# EAGLE design sensorBoard (EAGLE 7.2.0)
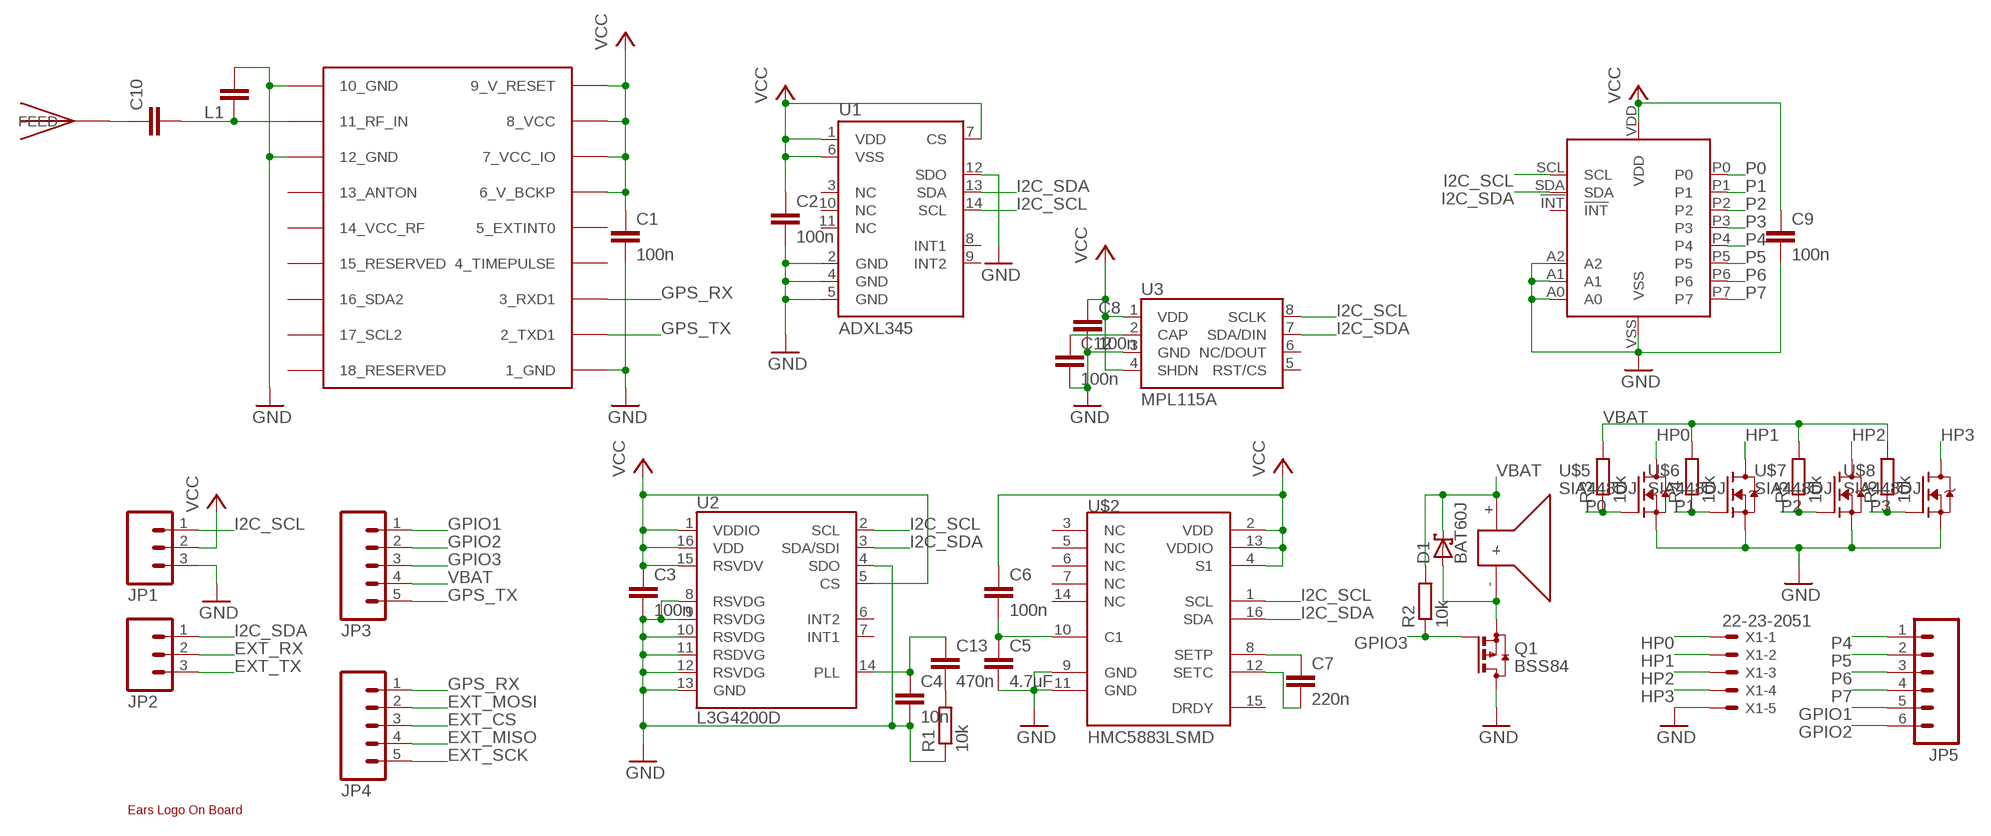
[diagram p0: schematic, sheet 1]

## Parts
C1  100n  C-EUC0402  [C0402]
C2  100n  C-EUC0402  [C0402]
C3  100n  C-EUC0402  [C0402]
C4  10n  C-EUC0402  [C0402]
C5  4.7uF  C-EUC0402  [C0402]
C6  100n  C-EUC0402  [C0402]
C7  220n  C-EUC0402  [C0402]
C8  100n  C-EUC0402  [C0402]
C9  100n  C-EUC0402  [C0402]
C10  C-EUC0603  [C0603]
C12  100n  C-EUC0402  [C0402]
C13  470n  C-EUC0402  [C0402]
D1  BAT60J  [SOD323_ST]
JP1  M03PTH  [1X03]
JP2  M03PTH  [1X03]
JP3  M05PTH  [1X05]
JP4  M05PTH  [1X05]
JP5  M06SIP  [1X06]
L1  C-EUC0603  [C0603]
Q1  BSS84  [SOT23]
R1  10k  R-EU_R0402  [R0402]
R2  10k  R-EU_R0402  [R0402]
R3  10k  R-EU_R0402  [R0402]
R4  10k  R-EU_R0402  [R0402]
R5  10k  R-EU_R0402  [R0402]
R6  10k  R-EU_R0402  [R0402]
U1  ADXL345  [LGA14]
U2  L3G4200D  [LGA16-4X4]
U3  MPL115A  [LGA8]
U$1  UBLOX_MAX  [UBLOX_MAX]
U$2  HMC5883LSMD  [16LPCC]
U$3  KSSG23J12  [KSSG23J12]
U$4  PCAL9554B  [PCAL9554B]
U$5  SIA448DJ  [SIA448DJ]
U$6  SIA448DJ  [SIA448DJ]
U$7  SIA448DJ  [SIA448DJ]
U$8  SIA448DJ  [SIA448DJ]
U$9  JTI_ANTENNA-1575AT43A40  [JTI_ANTENNA-1575AT43A40]
U$10  EARS-LOGO  [EARS-LOGO]
X1  22-23-2051  [22-23-2051]

## Nets
EXT_CS: JP4.3
EXT_MISO: JP4.4
EXT_MOSI: JP4.2
EXT_RX: JP2.2
EXT_SCK: JP4.5
EXT_TX: JP2.3
GND: C1.2 C2.2 C3.2 C4.2 C5.2 C8.2 C9.2 C12.2 JP1.3 L1.2 Q1.3(D) R1.1 U1.2(GND) U1.4(GND) U1.5(GND) U1.12(SDO) U2.4(SDO) U2.8(RSVDG) U2.9(RSVDG) U2.10(RSVDG) U2.11(RSDVG) U2.12(RSVDG) U2.13(GND) U3.3(GND) U$1.1_GND U$1.10_GND U$1.12_GND U$2.9(GND) U$2.11(GND) U$4.A0 U$4.A1 U$4.A2 U$4.VSS U$5.S0(S) U$5.S4(S) U$6.S0(S) U$6.S4(S) U$7.S0(S) U$7.S4(S) U$8.S0(S) U$8.S4(S) X1.5
GPIO1: JP3.1 JP5.5
GPIO2: JP3.2 JP5.6
GPIO3: JP3.3 Q1.1(G) R2.1
GPS_RX: JP4.1 U$1.3_RXD1
GPS_TX: JP3.5 U$1.2_TXD1
HP0: U$5.D0(D) U$5.D1(D) U$5.D2(D) U$5.D5(D) U$5.D6(D) X1.1
HP1: U$6.D0(D) U$6.D1(D) U$6.D2(D) U$6.D5(D) U$6.D6(D) X1.2
HP2: U$7.D0(D) U$7.D1(D) U$7.D2(D) U$7.D5(D) U$7.D6(D) X1.3
HP3: U$8.D0(D) U$8.D1(D) U$8.D2(D) U$8.D5(D) U$8.D6(D) X1.4
I2C_SCL: JP1.1 U1.14(SCL) U2.2(SCL) U3.8(SCLK) U$2.1(SCL) U$4.SCL
I2C_SDA: JP2.1 U1.13(SDA) U2.3(SDA/SDI) U3.7(SDA/DIN) U$2.16(SDA) U$4.SDA
N$1: C4.1 C13.1 U2.14(PLL)
N$2: C5.1 C6.2 U$2.10(C1)
N$3: C7.2 U$2.12(SETC)
N$4: C7.1 U$2.8(SETP)
N$5: D1.A Q1.2(S) U$3.-
N$6: C10.1 U$9.FEED
N$7: C10.2 L1.1 U$1.11_RF_IN
N$8: C12.1 U3.2(CAP)
N$9: C13.2 R1.2
P0: R3.1 U$4.P0 U$5.G3(G)
P1: R4.1 U$4.P1 U$6.G3(G)
P2: R5.1 U$4.P2 U$7.G3(G)
P3: R6.1 U$4.P3 U$8.G3(G)
P4: JP5.1 U$4.P4
P5: JP5.2 U$4.P5
P6: JP5.3 U$4.P6
P7: JP5.4 U$4.P7
VBAT: D1.C JP3.4 R2.2 R3.2 R4.2 R5.2 R6.2 U$3.+
VCC: C1.1 C2.1 C3.1 C6.1 C8.1 C9.1 JP1.2 U1.1(VDD) U1.6(VSS) U1.7(CS) U2.1(VDDIO) U2.5(CS) U2.15(RSVDV) U2.16(VDD) U3.1(VDD) U3.4(SHDN) U$1.6_V_BCKP U$1.7_VCC_IO U$1.8_VCC U$1.9_V_RESET U$2.2(VDD) U$2.4(S1) U$2.13(VDDIO) U$4.VDD
Unconnected: U1.3(NC) U1.8(INT1) U1.9(INT2) U1.10(NC) U1.11(NC) U2.6(INT2) U2.7(INT1) U3.5(RST/CS) U3.6(NC/DOUT) U$1.4_TIMEPULSE U$1.5_EXTINT0 U$1.13_ANTON U$1.14_VCC_RF U$1.15_RESERVED U$1.16_SDA2 U$1.17_SCL2 U$1.18_RESERVED U$2.3(NC) U$2.5(NC) U$2.6(NC) U$2.7(NC) U$2.14(NC) U$2.15(DRDY) U$4.!INT

## Library data of the parts
C1-C10 C12 C13 L1 = rcl:C-EU: CAPACITOR, European symbol
D1 = diode:BAT60J: Schottky barrier diode Source: www.st.com, BAT60J.pdf; OC_FARNELL: 1466524
JP1 JP2 = SparkFun:M03: Header 3 Standard 3-pin 0.1" header. Use with straight break away headers (SKU : PRT-00116), right angle break away headers (PRT-00553), swiss pins (PRT-00743), machine pins (PRT-00117), and female headers (PRT-00115). Molex polarized connector foot print use with SKU : PRT-08232 with associated crimp pins and housings.
JP3 JP4 = SparkFun:M05: Header 5 Standard 5-pin 0.1" header. Use with straight break away headers (SKU : PRT-00116), right angle break away headers (PRT-00553), swiss pins (PRT-00743), machine pins (PRT-00117), and female headers (PRT-00115). Molex polarized connector foot print use with SKU : PRT-08230 with associated crimp pins and housings.
JP5 = SparkFun:M06: Header 6 Standard 6-pin 0.1" header. Use with straight break away headers (SKU : PRT-00116), right angle break away headers (PRT-00553), swiss pins (PRT-00743), machine pins (PRT-00117), and female headers (PRT-00115). Molex polarized connector foot print use with SKU : PRT-08094 with associated crimp pins and housings. NOTES ON THE VARIANTS LOCK and LOCK_LONGPADS... This footprint was designed to help hold the alignment of a through-hole component (i.e. 6-pin header) while soldering it into place. You may notice that each hole has been shifted either up or down by 0.005 of an inch from it's more standard position (which is a perfectly straight line). This slight alteration caused the pins (the squares in the middle) to touch the edges of the holes. Because they are alternating, it causes a "brace" to hold the component in place. 0.005 has proven to be the perfect amount of "off-center" position when using our standard breakaway headers. Although looks a little odd when you look at the bare footprint, once you have a header in there, the alteration is very hard to notice. Also, if you push a header all the way into place, it is covered up entirely on the bottom side. This idea of altering the position of holes to aid alignment will be further integrated into the Sparkfun Library for other footprints. It can help hold any component with 3 or more connection pins.
Q1 = transistor-small-signal:BSS84: P-CHANNEL MOS FET
R1-R6 = rcl:R-EU_: RESISTOR, European symbol
U1 = SparkFun:ADXL345; OC_FARNELL: 2361527
U2 = SparkFun:L3G4200D: L3G4200D Three-axis, digital output gyroscope The L3G4200D is a low-power three-axis angular rate sensor, has a full scale of ±250/±500/±2000 dps and is capable of measuring rates with a user-selectable bandwidth. It includes a sensing element and an IC interface capable of providing the measured angular rate to the external world through a digital interface (I2C/SPI). Package: 4x4x1.1 LGA-16 (LGA16-4x4.PAC); OC_FARNELL: 2433080
U3 = SparkFun:MPL115A: MPL115A1 (SPI) and MPL115A2 (I2C) Miniature Digital Barometer 5.0x3.0x1.2mm LGA Package; OC_FARNELL: 2009084
U$1 = Ava:UBLOX_MAX: UBLOX MAX
U$2 = SparkFun:HMC5883L: 3 Axis Digital Compass IC
U$3 = mattsLib:KSSG23J12; OC_FARNELL: 2215090
U$4 = mattsLib:PCAL9554B; OC_FARNELL: 2428176
U$5-U$8 = mattsLib:SIA448DJ; OC_FARNELL: 2283661
U$9 = Ava:JTI_ANTENNA-1575AT43A40
U$10 = earsLogo:EARS-LOGO
X1 = con-molex:22-23-2051: .100" (2.54mm) Center Header - 5 Pin; MF: MOLEX; MPN: 22-23-2051; OC_FARNELL: 1462952; OC_NEWARK: 38C9178

## Board
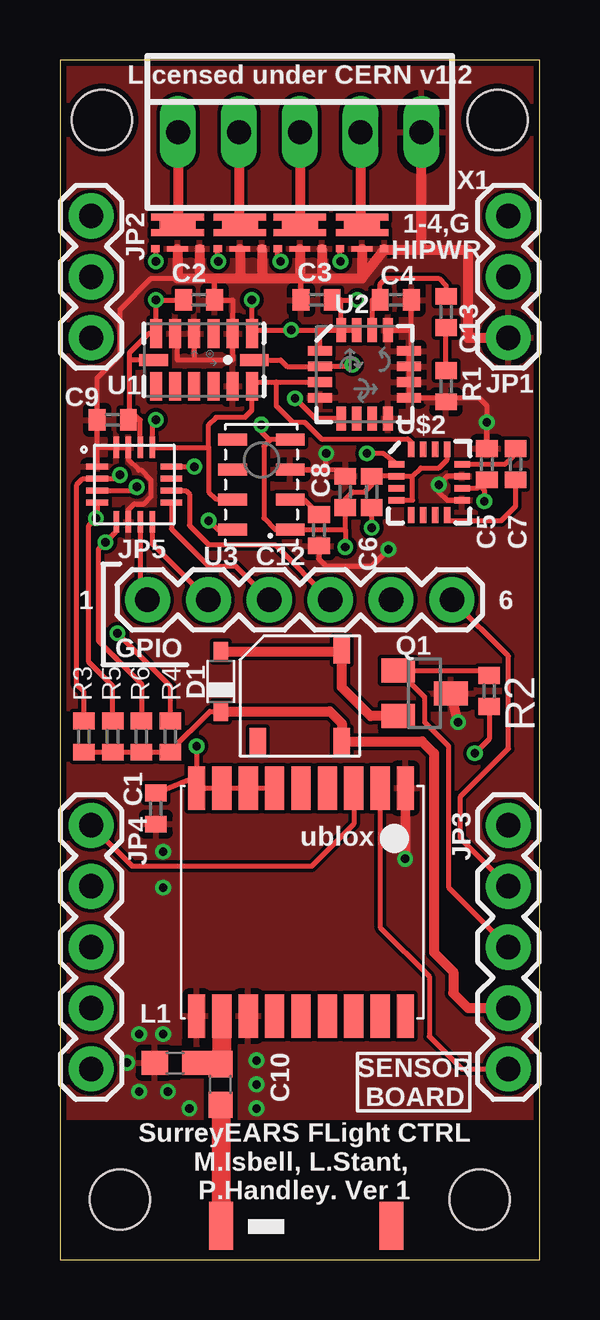
[diagram p1: board, top side]
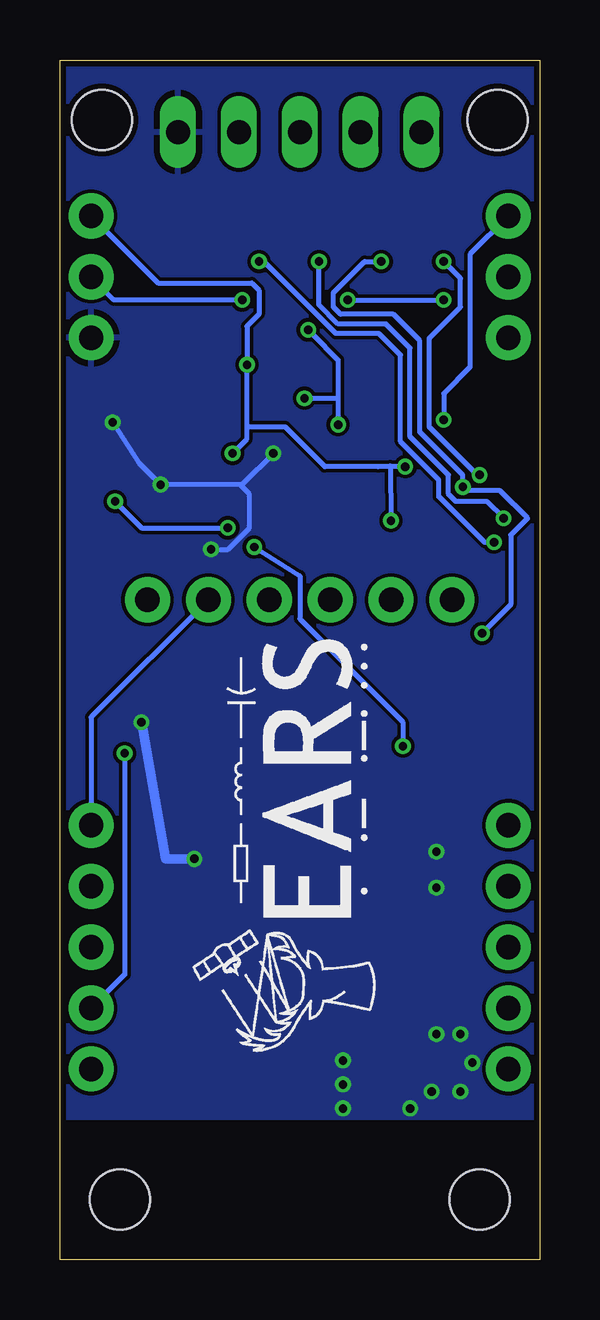
[diagram p2: board, bottom side, seen from below]

Size 20 x 50 mm. Coordinates in mm from the lower left corner, seen from the top.
Outline: 0,0 20,0 20,50 0,50 0,0
Copper layers (1*16): Top 0.035mm / dielectric 1.5mm / Bottom 0.035mm
Design rules "SeeedStudio_2layer_DRU_no_angle_20140221": minimum track width 6mil, minimum drill 12mil, track to track 6mil, track to pad 6mil, pad to pad 6mil, via to via 6mil, smd to smd 0mil, copper to edge 10mil, drill to drill 10mil, minimum pad ring 10mil, minimum via ring 6mil, stop-mask expansion 2mil, vias tented up to drill 100mil, thermal gap 10mil
Holes 2.5 mm at 1.75,47.5 18.25,47.5 2.5,2.5 17.5,2.5
tKeepout: area 0,45 to 3.5,50; area 16.5,45 to 20,50; area 0,0 to 5,5; area 15,0 to 20,5
bKeepout: area 0,45 to 3.5,50; area 16.5,45 to 20,50; area 0,0 to 5,5; area 15,0 to 20,5
tRestrict: area 6,5.7 to 7.4,9.2; area 4.5,7.5 to 5.3,9.2

### Footprints (pad centres in the part's own frame; a part is rotated, then mirrored left to right if it is on the bottom)
C0402 = smd 0.7 x 0.9: 1 -0.65,0; 2 0.65,0
C0603 = smd 1.1 x 1: 1 -0.85,0; 2 0.85,0
SOD323_ST = smd 0.8 x 0.6: A 1.25,0; C -1.25,0
1X03 = drill 1.016 pad 1.88: 1 0,0; 2 2.54,0; 3 5.08,0
1X05 = drill 1.016 pad 1.88: 1 0,0; 2 2.54,0; 3 5.08,0; 4 7.62,0; 5 10.16,0
1X06 = drill 1.016 pad 1.88: 1 0,0; 2 2.54,0; 3 5.08,0; 4 7.62,0; 5 10.16,0; 6 12.7,0
SOT23 = smd 1 x 1.4: 1 -0.95,-1.1; 2 0.95,-1.1; 3 0,1.1
R0402 = smd 0.7 x 0.9: 1 -0.65,0; 2 0.65,0
LGA14 = smd 0.5 x 1.2: 1 2,1.1; 2 1.2,1.1; 3 0.4,1.1; 4 -0.4,1.1; 5 -1.2,1.1; 6 -2,1.1; 8 -2,-1.1; 9 -1.2,-1.1; 10 -0.4,-1.1; 11 0.4,-1.1; 12 1.2,-1.1; 13 2,-1.1 | smd 1.2 x 0.5: 7 -2.1,0; 14 2.1,0
LGA16-4X4 = smd 1 x 0.4: 1 -1.85,0.975; 2 -1.85,0.325; 3 -1.85,-0.325; 4 -1.85,-0.975; 9 1.85,-0.975; 10 1.85,-0.325; 11 1.85,0.325; 12 1.85,0.975 | smd 0.4 x 1: 5 -0.975,-1.85; 6 -0.325,-1.85; 7 0.325,-1.85; 8 0.975,-1.85; 13 0.975,1.85; 14 0.325,1.85; 15 -0.325,1.85; 16 -0.975,1.85
LGA8 = smd 1.2 x 0.5: 1 -1.2,1.875; 2 -1.2,0.625; 3 -1.2,-0.625; 4 -1.2,-1.875; 5 1.2,-1.875; 6 1.2,-0.625; 7 1.2,0.625; 8 1.2,1.875
UBLOX_MAX = smd 1.8 x 0.7: 1_GND 4.95,-4.4; 9_V_RESET 4.95,4.3; 10_GND -4.55,4.3; 18_RESERVED -4.55,-4.4 | smd 1.8 x 0.8: 2_TXD1 4.95,-3.35; 3_RXD1 4.95,-2.25; 4_TIMEPULSE 4.95,-1.15; 5_EXTINT0 4.95,-0.05; 6_V_BCKP 4.95,1.05; 7_VCC_IO 4.95,2.15; 8_VCC 4.95,3.25; 11_RF_IN -4.55,3.25; 12_GND -4.55,2.15; 13_ANTON -4.55,1.05; 14_VCC_RF -4.55,-0.05; 15_RESERVED -4.55,-1.15; 16_SDA2 -4.55,-2.25; 17_SCL2 -4.55,-3.35
16LPCC = smd 0.65 x 0.28: 1 -1.37,0.75; 2 -1.37,0.25; 3 -1.37,-0.25; 4 -1.37,-0.75; 9 1.37,-0.75; 10 1.37,-0.25; 11 1.37,0.25; 12 1.37,0.75 | smd 0.28 x 0.65: 5 -0.75,-1.37; 6 -0.25,-1.37; 7 0.25,-1.37; 8 0.75,-1.37; 13 0.75,1.37; 14 0.25,1.37; 15 -0.25,1.37; 16 -0.75,1.37
KSSG23J12 = smd 1.1 x 0.7: + -1.9,-1.75; - 1.9,-1.75; P$3 -1.9,1.75
PCAL9554B = smd 0.9 x 0.24: !INT 1.55,0.25; A2 -1.55,0.75; P0 -1.55,0.25; P1 -1.55,-0.25; P2 -1.55,-0.75; P6 1.55,-0.75; P7 1.55,-0.25; SCL 1.55,0.75 | smd 0.24 x 0.9: A0 -0.25,1.55; A1 -0.75,1.55; P3 -0.75,-1.55; P4 0.25,-1.55; P5 0.75,-1.55; SDA 0.75,1.55; VDD 0.25,1.55; VSS -0.25,-1.55
SIA448DJ = smd 0.95 x 1.5: D0 -0.325,0 | smd 0.3 x 0.35: D1 -0.65,-0.925; D2 0,-0.925; D5 0,0.925; D6 -0.65,0.925; G3 0.667,-0.925; S4 0.667,0.925 | smd 0.235 x 0.87: S0 0.667,0
JTI_ANTENNA-1575AT43A40 = smd 1 x 2: FEED -3.175,0; NC 3.925,0
22-23-2051 = drill 1 long: 1 -5.08,0; 2 -2.54,0; 3 0,0; 4 2.54,0; 5 5.08,0

### Placement (x,y rotation side)
C1  4,18.8 270 top
C2  5.8,40 0 top
C3  10.7,40 180 top
C4  14,40 0 top
C5  17.8,33.15 90 top
C6  13,32 270 top
C7  19,33.15 90 top
C8  11.9,32 90 top
C9  2.2,35 180 top
C10  6.7,7.3 90 top
C12  10.8,30.4 270 top
C13  16.1,39.5 270 top
D1  6.7,24.1 90 top
JP1  18.7,43.5 270 top
JP2  1.3,43.5 270 top
JP3  18.7,18.1 270 top
JP4  1.3,18.1 270 top
JP5  3.65,27.5 0 top
L1  4.8,8.2 180 top
Q1  15.2,23.6 270 top
R1  16.1,36.4 90 top
R2  17.9,23.7 270 top
R3  1,21.8 270 top
R4  4.6,21.8 270 top
R5  2.2,21.8 270 top
R6  3.4,21.8 270 top
U1  6,37.5 0 top
U2  12.7,36.9 0 top
U3  8.4,32.3 180 top
U$1  10,14.7 90 top
U$2  15.4,32.4 0 top
U$3  10,23.5 90 top
U$4  3.1,32.3 0 top
U$5  4.9,42.8 270 top
U$6  7.5,42.8 270 top
U$7  10,42.8 270 top
U$8  12.6,42.8 270 top
U$9  9.9,1.4 0 top
U$10  9.7,18.1 90 bottom
X1  10,47 0 top

### Tracks (layer width: path | path; a pad name or v marks a point on that pad's centre or on a via)
GND  (via drill 0.35)
  Top 0.2: U$4.A2 1.55,33.85 | 1.55,33.85 C9.2 1.55,36.75 2.5,37.7 2.5,39.6 3.8,40.9 4.9,40.9 | 1.55,33.85 U$4.A1 U$4.A0 2.85,33.35 3.3,32.9 3.4,32.9 3.8,32.5 3.8,31.8 3.5,31.5 3.1,31.5 2.85,31.25 U$4.VSS | 6.3,40.9 6.45,41 C2.2 7.2,40 U1.2 7.2,37.5 5.6,37.5 | 5.6,37.5 4.9,37.5 4.9,38.6 U1.5 | U1.4 5.6,37.5 | C3.2 10.05,41 10,40.9 | U2.13 14.65,38.75 | 14.65,38.75 C4.2 | 14.65,38.75 14.65,37.88 U2.12 U2.11 U2.10 U2.9 17.48,35.92 17.8,35.6 C5.2 v17.8,34.9 | U3.3 11.2,32.92 | 11.2,32.92 11.8,32.92 11.8,32.8 C8.2 | U$2.11 16.15,32.65 v15.8,32.3 15.8,32 16.15,31.65 U$2.9 | 11.2,32.92 11.1,33.02 v11.1,33.6 | C12.2 10.8,29.2 11.1,28.9 13,28.9 v13.7,29.6
  Top 0.4: U$1.1_GND v14.4,16.7 | v16.6,22.4 Q1.3
  Top 0.406: U$5.S0 4.9,40.9 5.83,40.9 | 5.83,40.9 6.3,40.9 7.5,40.9 | 7.5,40.9 8.43,40.9 | 8.43,40.9 10,40.9 | 10,40.9 10.93,40.9 | 10.93,40.9 12.6,40.9 | 12.6,40.9 13.53,42.1 | 13.53,42.1 15.08,42.1 | 15.08,42.1 X1.5 | U$5.S4 5.83,40.9 | U$6.S0 7.5,40.9 | U$6.S4 8.43,40.9 | U$7.S0 10,40.9 | U$7.S4 10.93,40.9 | U$8.S0 12.6,40.9 | U$8.S4 13.53,42.1 | 15.08,42.1 17,42.1 17,38.42 JP1.3
  Bottom 0.2: v17.8,34.9 16.7,33.2 v15.8,32.3 12.5,32.3 | v11.1,33.6 12.4,32.3 12.5,32.3 | v13.7,29.6 13,29.6 12.1,30.5 12.1,31.9 12.5,32.3
  Bottom 0.4: v14.4,16.7 15.6,16.7 v16.6,22.4
  other vias: 5.4,6.3 4.5,7 3.3,7 3.3,9.4 4.3,9.4 2.8,8.2 8.2,8.3 8.2,7.3 8.2,6.3 4.3,17 4.3,15.5
  pour Bottom: 0,50 0,5.9 20,5.9 20,50
  pour Top: 20,5.9 0,5.9 0,50 20,50
GPIO1
  Bottom 0.2: JP5.5 18.7,22.61 JP3.1
GPIO2
  Top 0.2: JP3.2 16.7,17.56 16.7,19.3 18.7,21.3 18.7,25.15 JP5.6
GPIO3
  Top 0.2: JP3.3 16.2,15.52 16.2,21.4 15.2,22.4 15.2,23.45 Q1.1 17.9,24.55 R2.1
GPS_RX
  Top 0.2: U$1.3_RXD1 12.25,18.15 10.5,16.4 3,16.4 JP4.1
GPS_TX
  Top 0.2: U$1.2_TXD1 13.35,13.85 15.4,11.8 15.4,9.3 16.76,7.94 JP3.5
HP0
  Top 0.3: U$5.D1 4.9,43.45 | U$5.D6 4.9,43.45 | 4.9,43.45 U$5.D0 4.9,42.8 | U$5.D2 4.9,42.8 | U$5.D5 4.9,42.8
  Top 0.406: X1.1 4.92,43.12 U$5.D0
HP1
  Top 0.3: U$6.D2 7.5,42.8 | U$6.D1 7.5,43.45 | U$6.D6 7.5,43.45 | 7.5,43.45 U$6.D0 7.5,42.8 | U$6.D5 7.5,42.8
  Top 0.406: X1.2 7.46,43.12 U$6.D0
HP2
  Top 0.3: U$7.D1 10,43.45 | U$7.D2 10,42.8 | U$7.D5 10,42.8 | 10,42.8 U$7.D0 10,43.45 | U$7.D6 10,43.45
  Top 0.406: X1.3 U$7.D0
HP3
  Top 0.3: U$8.D1 12.6,43.45 | 12.6,43.45 U$8.D0 12.6,42.8 | U$8.D2 12.6,42.8 | 12.6,43.45 U$8.D6 | U$8.D5 12.6,42.8
  Top 0.406: X1.4 12.54,43.12 U$8.D0
I2C_SCL  (via drill 0.35)
  Top 0.2: U1.14 9.2,37.5 9.47,37.23 U2.2 12.12,37.23 v12.2,37.3 | U$2.1 13.48,33.6 v12.8,33.6 | U$4.SCL v5.6,33.05 | v6.2,30.8 6.6,30.43 U3.8
  Bottom 0.2: JP1.1 15.9,40.7 12,40.7 11.7,40.4 11.7,39.4 12.2,38.9 v12.2,37.3 12.2,34.7 | v12.8,33.6 12.2,34.2 12.2,34.7 | v5.6,33.05 6.72,33.05 | 6.72,33.05 8.95,33.05 10.6,34.7 12.2,34.7 | 6.72,33.05 6.22,33.08 v6.2,30.8
I2C_SDA  (via drill 0.35)
  Top 0.2: 6.2,33.85 U$4.SDA 3.85,34.85 v4,35 | 6.2,33.85 6.2,32 6.5,31.7 7.28,31.7 U3.7 | 6.2,33.85 6.2,34.8 6.5,35.1 7.7,35.1 8,35.4 U1.13 8.18,36.58 9.01,36.58 | 9.01,36.58 U2.3 | 9.01,36.58 9.01,35.59 9.7,34.9 10.2,34.9 10.9,34.2 14.5,34.2 14.65,34.05 U$2.16
  Bottom 0.2: JP2.1 2.9,41.9 2.9,37.2 4,36.1 v4,35
N$1
  Top 0.2: U2.14 13.03,40 C4.1 13.35,40.65 13.6,40.9 15.8,40.9 16.1,40.6 C13.1
N$2  (via drill 0.35)
  Top 0.2: U$2.10 17.4,32.15 17.51,32.26 | 17.51,32.26 C5.1 | 17.51,32.26 17.7,32.07 v17.7,31.6 | v13,30.5 C6.2
  Bottom 0.2: v17.7,31.6 16.6,30.5 v13,30.5
N$3
  Top 0.2: U$2.12 18.55,33.15 18.9,33.5 C7.2
N$4
  Top 0.2: C7.1 19,31.4 18.4,30.8 16.15,30.8 U$2.8
N$5
  Top 0.406: Q1.2 12.95,22.65 11.75,23.85 U$3.- 11.75,25.35 D1.A
N$6
  Top 0.8: C10.1 6.72,6.45 U$9.FEED
N$7
  Top 0.8: U$1.11_RF_IN 6.75,8.15 C10.2 5.65,8.15 L1.1
N$8
  Top 0.2: U3.2 10.18,31.68 C12.1
N$9
  Top 0.2: R1.2 C13.2
P0  (via drill 0.35)
  Top 0.2: v2.5,32.7 2.35,32.55 U$4.P0 0.95,32.55 0.7,32.3 0.7,23.95 1,23.65 R3.1 | v4,41.6 4,42.11 U$5.G3
  Bottom 0.2: v2.5,32.7 2.6,32.7 4.6,34.7 4.6,38.4 3.3,39.7 3.3,40.9 v4,41.6
P1  (via drill 0.35)
  Top 0.2: U$4.P1 3.05,32.05 v3.2,32.2 | v6.6,41.6 6.58,41.62 U$6.G3 | v2.4,26.1 4.6,23.9 R4.1
  Bottom 0.2: v6.6,41.6 7.3,41.6 8.6,40.3 8.6,39.7 8.3,39.4 6.1,39.4 5,38.3 5,34.5 3.2,32.7 v3.2,32.2 3.05,32.05 1.65,32.05 0.5,30.9 1.2,30.2 1.2,27.3 v2.4,26.1
P2  (via drill 0.35)
  Top 0.2: U$4.P2 1.55,30.95 v1.5,30.9 1.2,30.6 1.2,24.9 2.2,23.9 R5.1 | v9.2,41.6 9.07,41.73 U$7.G3
  Bottom 0.2: v1.5,30.9 2.2,31.6 3.5,31.6 3.8,31.9 3.8,32.7 5.4,34.3 5.4,38 6.4,39 8.4,39 9.2,39.8 v9.2,41.6
P3  (via drill 0.35)
  Top 0.2: v11.7,41.6 11.68,41.62 U$8.G3 | R6.1 3.4,24 1.6,25.8 1.6,29.6 v1.9,29.9 2.35,30.35 U$4.P3
  Bottom 0.2: v11.7,41.6 11.5,41.6 8.5,38.6 6.7,38.6 5.8,37.7 5.8,34.1 4.2,32.5 4.2,31.8 2.3,29.9 v1.9,29.9
P4
  Top 0.2: U$4.P4 3.35,27.8 JP5.1
P5
  Top 0.2: U$4.P5 3.85,29.84 JP5.2
P6
  Top 0.2: U$4.P6 4.65,30.45 6.2,28.9 7.33,28.9 JP5.3
P7
  Top 0.2: U$4.P7 5.25,32.05 5.4,31.9 5.4,30.6 6.2,29.8 8.97,29.8 JP5.4
VBAT  (via drill 0.35)
  Top 0.2: R2.2 17.9,21.7 v17.3,21.1 | R3.2 R5.2 R6.2 R4.2 4.6,21.2 6.25,22.85 D1.C
  Top 0.406: JP3.4 17.02,10.48 16.4,11.1 16.4,12 15.6,12.8 15.6,21.1 15.1,21.6 U$3.+ 11.75,22.35 11.25,22.85 D1.C
  Bottom 0.2: v17.3,21.1 17.3,11.88 JP3.4
VCC  (via drill 0.35)
  Top 0.2: U$4.VDD 3.35,35 | 3.35,35 C9.1 | v8,40 U1.1 8,38.75 v9.65,38.75 10.85,38.75 | C2.1 v4,40 U1.6 3.7,38.6 2.9,37.8 2.9,37.5 | 10.85,38.75 U2.16 | U2.1 10.85,38.75 | U2.16 11.72,40 | 11.72,40 C3.1 | U2.16 U2.15 | 14.7,32.65 U$2.2 C6.1 | U$2.4 14.7,31.65 14.7,32.65 | 11.9,30.43 U3.1 8.97,30.43 8.5,30.9 8.5,33.9 8.78,34.17 U3.4 9.53,34.17 9.5,34.2 8.7,34.2 8.4,34.5 v8.4,34.8 | 11.9,30.43 C8.1 11.9,31.7 12.2,32 12.7,32 13,32.3 C6.1 | C6.1 12.65,32.65 | 14.7,32.65 15.05,33 15.8,33 16.15,33.35 U$2.13 | 11.72,40 v12.4,40 | v5.7,21.4 5.7,20.2 | 5.7,20.2 U$1.9_V_RESET U$1.8_VCC U$1.7_VCC_IO U$1.6_V_BCKP | 11.9,30.43 v11.9,29.7 | 3.35,35 2.9,35.45 2.9,37.5 | U1.7 2.9,37.5 | U2.5 10.65,35.05 v9.8,35.9 | C1.1 5.6,20.1 5.7,20.2
  Bottom 0.2: v8,40 v4,40 | v9.65,38.75 9.5,38.6 8.4,37.5 8.4,35.9 | 8.4,35.9 v8.4,34.8 | v12.4,40 17.74,40 JP1.2 | v11.9,29.7 10,28.5 10,26.7 5.7,22.4 v5.7,21.4 | v9.8,35.9 8.4,35.9

### Text on the board
tNames: Licensed under CERN v1.2 | 1-4,G | HIPWR | 1 | 6 | GPIO | SENSOR / BOARD | SurreyEARS FLight CTRL / M.Isbell, L.Stant, / P.Handley. Ver 1